# EAGLE design BackplaneConnector (EAGLE 6.6.0)
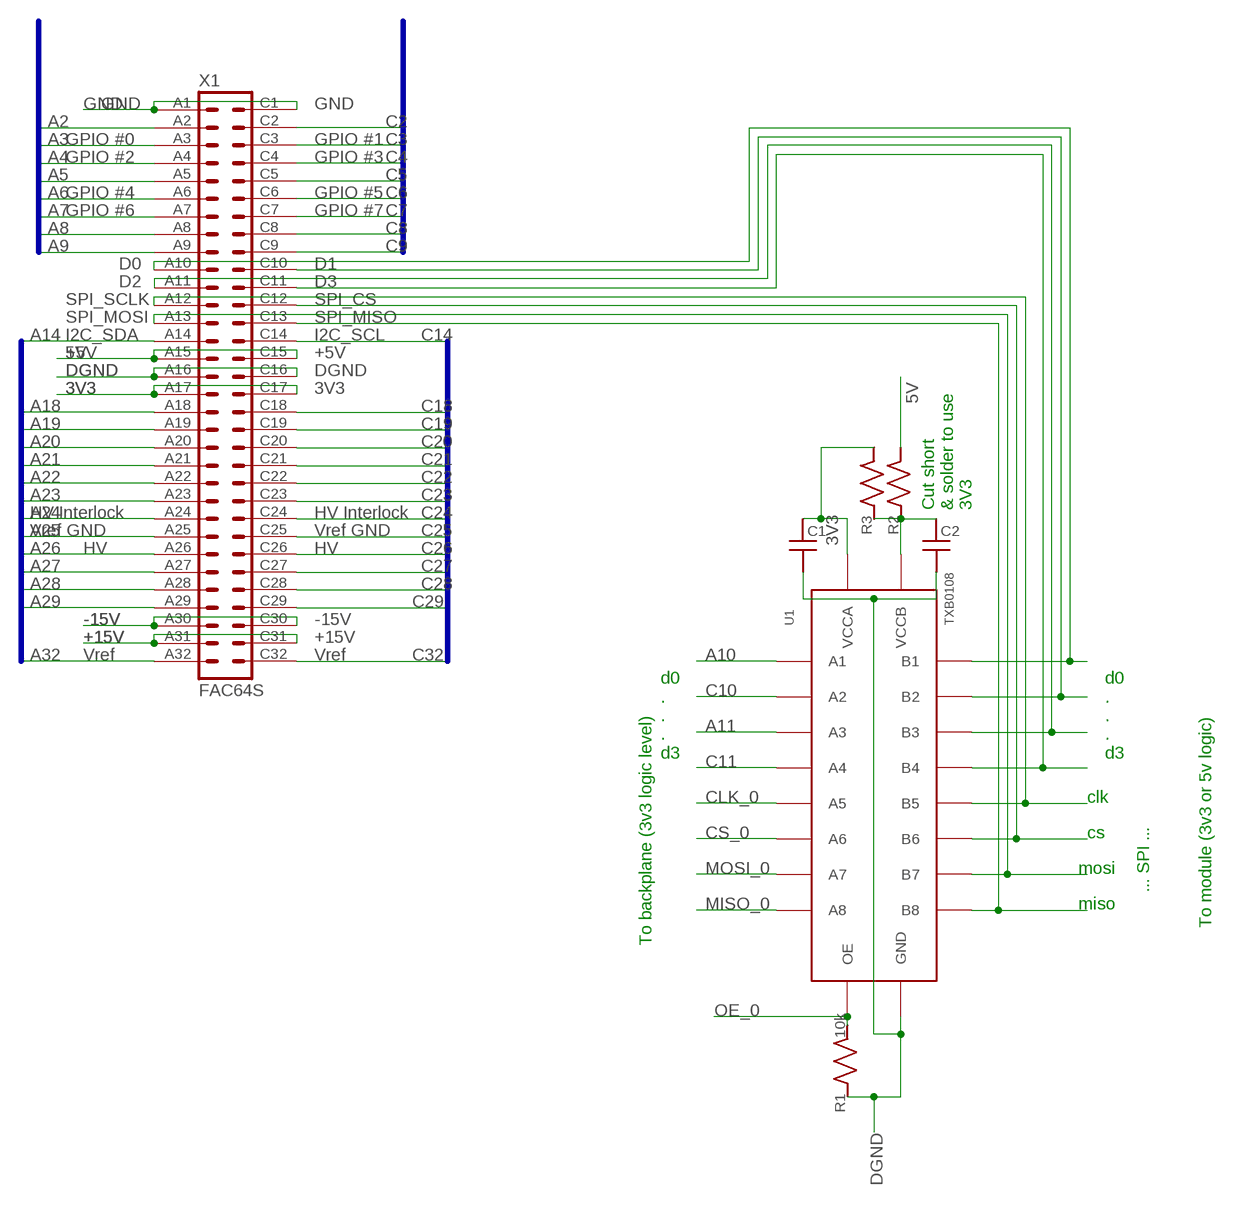
[diagram p0: schematic, sheet 1]

## Parts
C1  C_MLCC_SMDCMLCC_0603  [C_MLCC_0603]
C2  C_MLCC_SMDCMLCC_0603  [C_MLCC_0603]
R1  10k  R_SMDR0603  [R_0603]
R2  R_SMDR0603  [R_0603]
R3  R_SMDR0603  [R_0603]
U1  TXB0108  [TSSOP20]
X1  FAC64S  [FAC64S]

## Nets
3V3: C1.P$1 R3.P$2 U1.2(VCCA) X1.A17 X1.C17
5V: R2.P$2 X1.A15 X1.C15
+15V: X1.A31 X1.C31
-15V: X1.A30 X1.C30
A2: X1.A2
A3: X1.A3
A4: X1.A4
A5: X1.A5
A6: X1.A6
A7: X1.A7
A8: X1.A8
A9: X1.A9
A10: U1.1(A1)
A11: U1.4(A3)
A14: X1.A14
A18: X1.A18
A19: X1.A19
A20: X1.A20
A21: X1.A21
A22: X1.A22
A23: X1.A23
A24: X1.A24
A25: X1.A25
A26: X1.A26
A27: X1.A27
A28: X1.A28
A29: X1.A29
A32: X1.A32
C2: X1.C2
C3: X1.C3
C4: X1.C4
C5: X1.C5
C6: X1.C6
C7: X1.C7
C8: X1.C8
C9: X1.C9
C10: U1.3(A2)
C11: U1.5(A4)
C14: X1.C14
C18: X1.C18
C19: X1.C19
C20: X1.C20
C21: X1.C21
C22: X1.C22
C23: X1.C23
C24: X1.C24
C25: X1.C25
C26: X1.C26
C27: X1.C27
C28: X1.C28
C29: X1.C29
C32: X1.C32
CLK_0: U1.6(A5)
CS_0: U1.7(A6)
DGND: C1.P$2 C2.P$2 R1.P$1 U1.11(GND) X1.A16 X1.C16
GND: X1.A1 X1.C1
MISO_0: U1.9(A8)
MOSI_0: U1.8(A7)
N$1: U1.20(B1) X1.A10
N$2: U1.18(B2) X1.C10
N$3: U1.17(B3) X1.A11
N$4: U1.16(B4) X1.C11
N$5: U1.15(B5) X1.A12
N$6: U1.14(B6) X1.C12
N$7: U1.13(B7) X1.A13
N$8: U1.12(B8) X1.C13
N$9: C2.P$1 R2.P$1 R3.P$1 U1.19(VCCB)
OE_0: R1.P$2 U1.10(OE)

## Buses
A[1..32],C[1..32]

## Notes on the sheet
- Cut short
  & solder to use
  3V3
- d0
  .
  .
  .
  d3
- d0
  .
  .
  .
  d3
- clk
- cs
- mosi
- ... SPI ...
- miso
- To module (3v3 or 5v logic)
- To backplane (3v3 logic level)

## Library data of the parts
C1 C2 = jqi_passives:C_MLCC_SMD
R1-R3 = jqi_passives:R_SMD
U1 = Eurocard-Backplane-jqi:TXB0108: 8 channel level translator with auto-direction detect. http://www.ti.com/lit/ds/symlink/txb0108.pdf
X1 = Eurocard-Backplane-jqi:FAC64S: CONNECTOR female, 64 pins, block, type C, rows AC, grid 5.08 mm

## Board
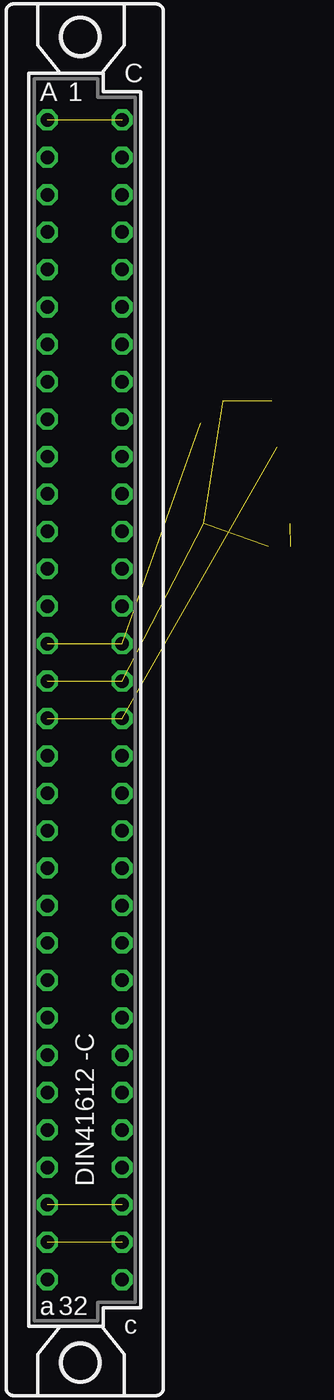
[diagram p1: board, top side]
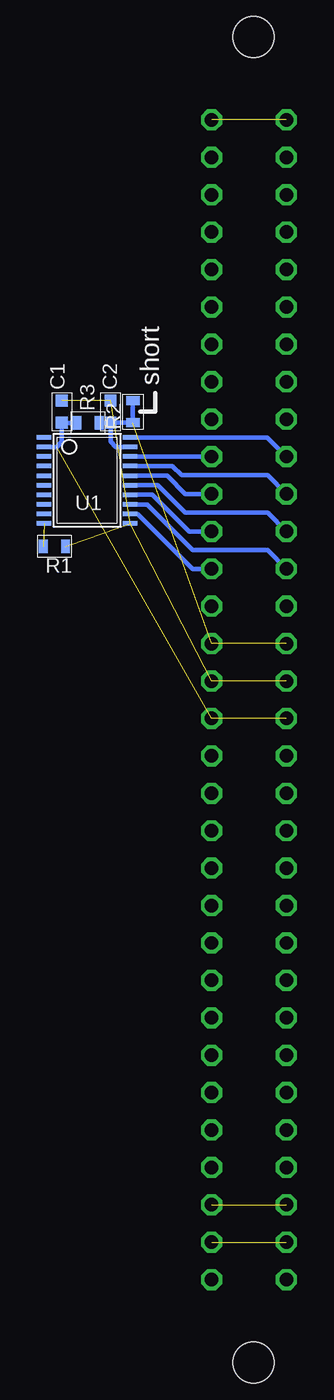
[diagram p2: board, bottom side, seen from below]

No outline drawn. Coordinates in mm, seen from the top.
Copper layers (1*2*3*14*15*16): Top 0.035mm / dielectric 1.5mm / Route2 0.035mm / dielectric 0.15mm / Route3 0.035mm / dielectric 0.2mm / Route14 0.035mm / dielectric 0.15mm / Route15 0.035mm / dielectric 0.2mm / Bottom 0.035mm
Design rules "default *": minimum track width 10mil, minimum drill 24mil, track to track 8mil, track to pad 8mil, pad to pad 8mil, via to via 8mil, smd to smd 8mil, copper to edge 40mil, drill to drill 8mil, minimum pad ring 10mil, minimum via ring 8mil, stop-mask expansion 4mil, vias tented up to drill 0mil, thermal gap 10mil

### Footprints (pad centres in the part's own frame; a part is rotated, then mirrored left to right if it is on the bottom)
C_MLCC_0603 = smd 0.8 x 0.8: P$1 -0.75,0; P$2 0.75,0
R_0603 = smd 0.6 x 0.9: P$1 -0.75,0; P$2 0.75,0
TSSOP20 = smd 0.305 x 0.991: 1 -2.575,-2.728; 2 -1.925,-2.728; 3 -1.275,-2.728; 4 -0.625,-2.728; 5 0.025,-2.728; 6 0.675,-2.728; 7 1.325,-2.728; 8 1.975,-2.728; 9 2.625,-2.728; 10 3.275,-2.728; 11 3.275,3.108; 12 2.625,3.108; 13 1.975,3.108; 14 1.325,3.108; 15 0.675,3.108; 16 0.025,3.108; 17 -0.625,3.108; 18 -1.275,3.108; 19 -1.925,3.108; 20 -2.575,3.108
FAC64S = drill 0.914 octagon: A1 -2.54,39.37; A2 -2.54,36.83; A3 -2.54,34.29; A4 -2.54,31.75; A5 -2.54,29.21; A6 -2.54,26.67; A7 -2.54,24.13; A8 -2.54,21.59; A9 -2.54,19.05; A10 -2.54,16.51; A11 -2.54,13.97; A12 -2.54,11.43; A13 -2.54,8.89; A14 -2.54,6.35; A15 -2.54,3.81; A16 -2.54,1.27; A17 -2.54,-1.27; A18 -2.54,-3.81; A19 -2.54,-6.35; A20 -2.54,-8.89; A21 -2.54,-11.43; A22 -2.54,-13.97; A23 -2.54,-16.51; A24 -2.54,-19.05; A25 -2.54,-21.59; A26 -2.54,-24.13; A27 -2.54,-26.67; A28 -2.54,-29.21; A29 -2.54,-31.75; A30 -2.54,-34.29; A31 -2.54,-36.83; A32 -2.54,-39.37; C1 2.54,39.37; C2 2.54,36.83; C3 2.54,34.29; C4 2.54,31.75; C5 2.54,29.21; C6 2.54,26.67; C7 2.54,24.13; C8 2.54,21.59; C9 2.54,19.05; C10 2.54,16.51; C11 2.54,13.97; C12 2.54,11.43; C13 2.54,8.89; C14 2.54,6.35; C15 2.54,3.81; C16 2.54,1.27; C17 2.54,-1.27; C18 2.54,-3.81; C19 2.54,-6.35; C20 2.54,-8.89; C21 2.54,-11.43; C22 2.54,-13.97; C23 2.54,-16.51; C24 2.54,-19.05; C25 2.54,-21.59; C26 2.54,-24.13; C27 2.54,-26.67; C28 2.54,-29.21; C29 2.54,-31.75; C30 2.54,-34.29; C31 2.54,-36.83; C32 2.54,-39.37 | hole 2.794: -0.305,45.009; -0.305,-45.009

### Placement (x,y rotation side)
C1  -6.35,67.82 90 bottom
C2  -9.65,67.82 90 bottom
R1  -5.84,58.67 180 bottom
R2  -11.18,67.82 90 bottom
R3  -8.13,67.06 180 bottom
U1  -7.87,63.5 270 bottom
X1  -19.05,48.26 0 top

### Tracks (layer width: path | path; a pad name or v marks a point on that pad's centre or on a via)
3V3  (2 unrouted)
  Bottom 0.305: U1.2 -5.99,65.42 -6.35,65.79 C1.P$1 -6.36,67.06 R3.P$2
5V  (2 unrouted)
  Bottom 0.305: R2.P$2 -11.18,67.06
+15V  (1 unrouted)
-15V  (1 unrouted)
DGND  (5 unrouted)
GND  (1 unrouted)
N$1
  Bottom 0.305: U1.20 -20.29,66.08 X1.A10
N$2
  Bottom 0.305: X1.C10 -12.77,64.77 U1.18
N$3
  Bottom 0.305: U1.17 -13.85,64.12 -14.48,63.5 -20.32,63.5 X1.A11
N$4
  Bottom 0.305: U1.16 -13.49,63.48 -14.73,62.23 X1.C11
N$5
  Bottom 0.305: U1.15 -12.87,62.83 -14.73,60.96 -20.32,60.96 X1.A12
N$6
  Bottom 0.305: U1.14 -12.5,62.17 -14.99,59.69 X1.C12
N$7
  Bottom 0.305: U1.13 -12.13,61.52 -15.24,58.42 -20.32,58.42 X1.A13
N$8
  Bottom 0.305: U1.12 -11.52,60.88 -15.24,57.15 X1.C13
N$9
  Bottom 0.305: U1.19 -10.01,65.42 -9.65,65.79 C2.P$1 | R3.P$1 -9.64,67.06 C2.P$1 | C2.P$1 R2.P$1
OE_0  (1 unrouted)

### Text on the board
bPlace: short